# EAGLE schematic rel-num-display (EAGLE 9.6.2)
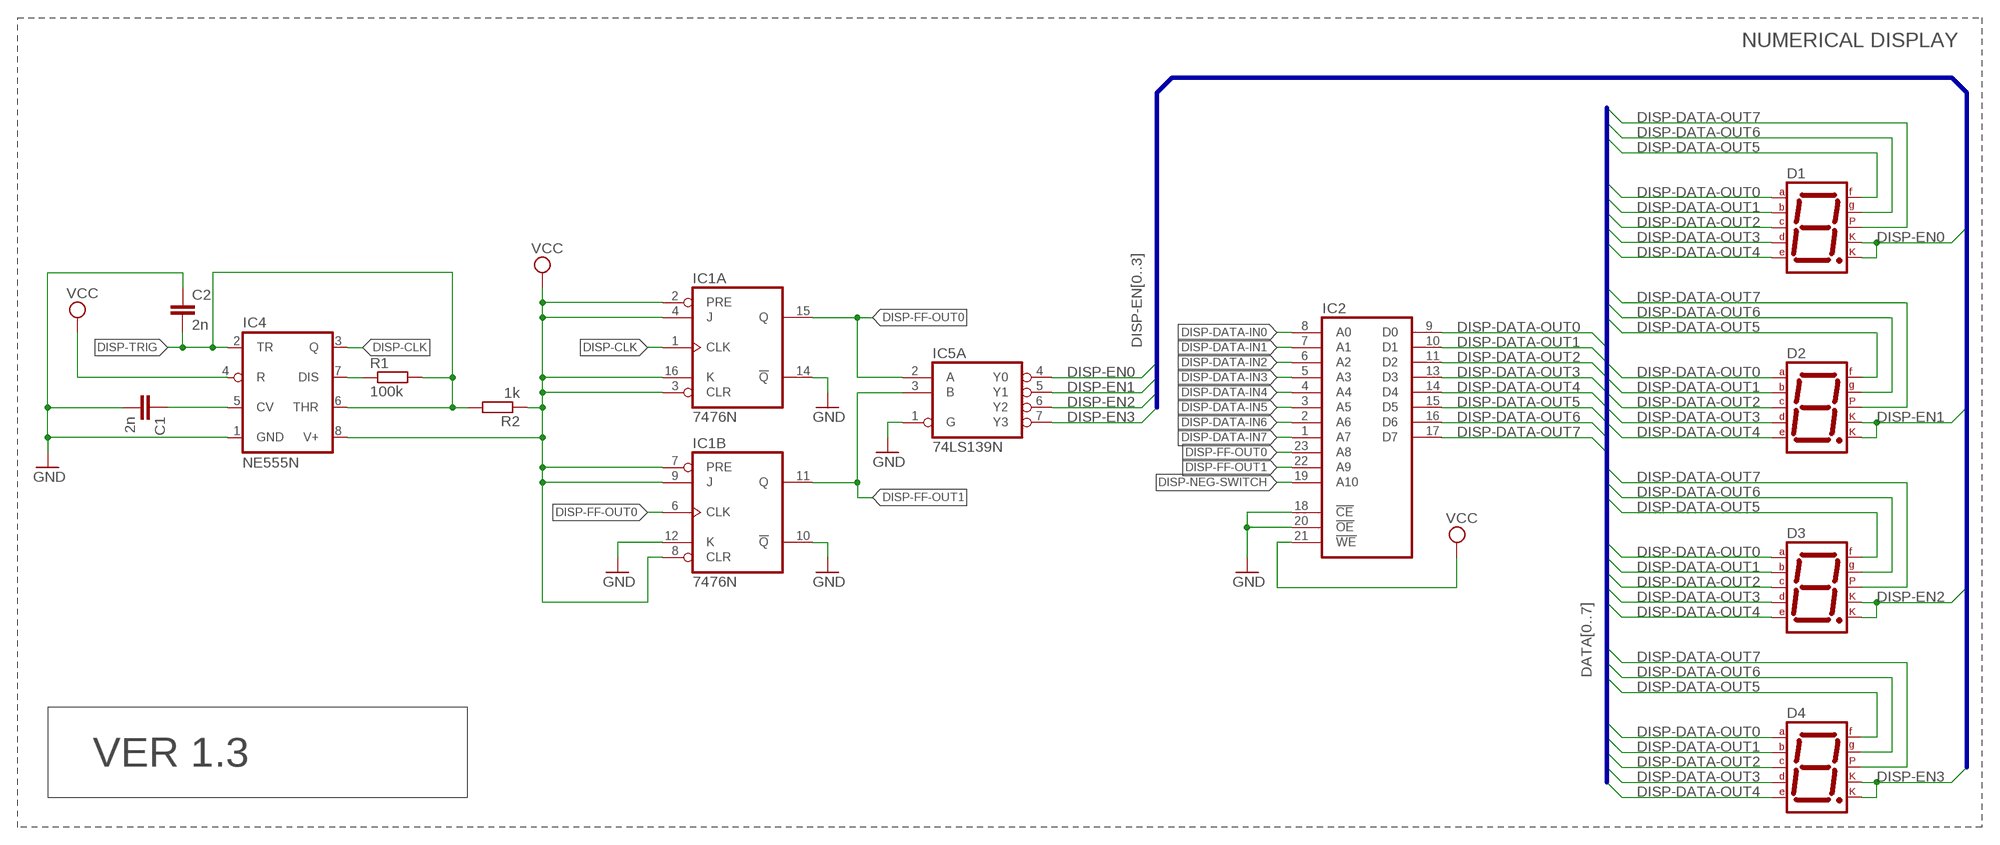
[diagram p0: schematic, sheet 1]

## Parts
C1  2n  C-EU025-025X050  [C025-025X050]
C2  2n  C-EU025-025X050  [C025-025X050]
D1  7SEG-CK  [7SEG-13]
D2  7SEG-CK  [7SEG-13]
D3  7SEG-CK  [7SEG-13]
D4  7SEG-CK  [7SEG-13]
IC1  7476N  [DIL16]
IC2  2816  [DIL24]
IC4  NE555N  [DIL08]
IC5  74LS139N  [DIL16]
R1  100k  R-EU_0204/5  [0204/5]
R2  1k  R-EU_0204/5  [0204/5]

## Nets
DISP-CLK: IC1.1(A:CLK) IC4.3(Q)
DISP-DATA-IN0: IC2.8(A0)
DISP-DATA-IN1: IC2.7(A1)
DISP-DATA-IN2: IC2.6(A2)
DISP-DATA-IN3: IC2.5(A3)
DISP-DATA-IN4: IC2.4(A4)
DISP-DATA-IN5: IC2.3(A5)
DISP-DATA-IN6: IC2.2(A6)
DISP-DATA-IN7: IC2.1(A7)
DISP-DATA-OUT0: D1.7(A) D2.7(A) D3.7(A) D4.7(A) IC2.9(D0)
DISP-DATA-OUT1: D1.6(B) D2.6(B) D3.6(B) D4.6(B) IC2.10(D1)
DISP-DATA-OUT2: D1.4(C) D2.4(C) D3.4(C) D4.4(C) IC2.11(D2)
DISP-DATA-OUT3: D1.2(D) D2.2(D) D3.2(D) D4.2(D) IC2.13(D3)
DISP-DATA-OUT4: D1.1(E) D2.1(E) D3.1(E) D4.1(E) IC2.14(D4)
DISP-DATA-OUT5: D1.9(F) D2.9(F) D3.9(F) D4.9(F) IC2.15(D5)
DISP-DATA-OUT6: D1.10(G) D2.10(G) D3.10(G) D4.10(G) IC2.16(D6)
DISP-DATA-OUT7: D1.5(DP) D2.5(DP) D3.5(DP) D4.5(DP) IC2.17(D7)
DISP-EN0: D1.3(CK1) D1.8(CK2) IC5.4(A:Y0)
DISP-EN1: D2.3(CK1) D2.8(CK2) IC5.5(A:Y1)
DISP-EN2: D3.3(CK1) D3.8(CK2) IC5.6(A:Y2)
DISP-EN3: D4.3(CK1) D4.8(CK2) IC5.7(A:Y3)
DISP-FF-OUT0: IC1.6(B:CLK) IC1.15(A:Q) IC2.23(A8) IC5.2(A:A)
DISP-FF-OUT1: IC1.11(B:Q) IC2.22(A9) IC5.3(A:B)
DISP-NEG-SWITCH: IC2.19(A10)
DISP-TRIG: C2.2 IC4.2(TR) IC4.6(THR) R1.2 R2.2
GND: C1.2 C2.1 IC1.10(B:!Q) IC1.12(B:K) IC1.14(A:!Q) IC2.18(!CE) IC2.20(!OE) IC4.1(GND) IC5.1(A:G)
N$1: IC4.7(DIS) R1.1
N$6: C1.1 IC4.5(CV)
VCC: IC1.2(A:PRE) IC1.3(A:CLR) IC1.4(A:J) IC1.7(B:PRE) IC1.8(B:CLR) IC1.9(B:J) IC1.16(A:K) IC2.21(!WE) IC4.4(R) IC4.8(V+) R2.1
Unconnected: IC5.9(B:Y3) IC5.10(B:Y2) IC5.11(B:Y1) IC5.12(B:Y0) IC5.13(B:B) IC5.14(B:A) IC5.15(B:G)

## Buses
DATA[0..7]
DISP-EN[0..3]

## Notes on the sheet
- NUMERICAL DISPLAY
- VER 1.3

## Power pins joined to a net without a drawn wire
GND: IC1.13(P:GND) IC2.12(GND) IC5.8(P:GND)
VCC: IC1.5(P:VCC) IC2.24(VCC) IC5.16(P:VCC)

## Library data of the parts
C1 C2 = resistor:C-EU: CAPACITOR, European symbol
D1-D4 = special:7SEG-CK: 7-segment DISPLAY single cathode, 13 mm
IC1 = 74xx-eu:74*76: Dual J-K FLIP FLOP, preset and clear
IC2 = memory:2816: MEMORY
IC4 = linear:*555: TIMER
IC5 = 74xx-eu:74*139: Dual 2-line to 4-line DECODER/DEMULTIPLEXER
R1 R2 = resistor:R-EU_: RESISTOR, European symbol